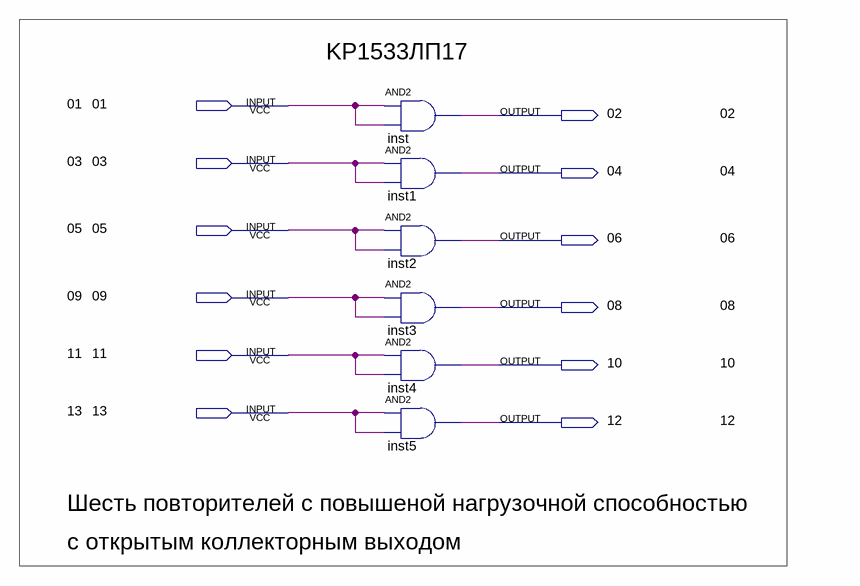
[diagram p0: schematic sheet]
// Quartus schematic KP1533LP17.bdf as structural Verilog: 6 symbols, 12 pins
module KP1533LP17 (
  input  \01 ,
  input  \03 ,
  input  \05 ,
  input  \09 ,
  input  \11 ,
  input  \13 ,
  output \02 ,
  output \04 ,
  output \06 ,
  output \08 ,
  output \10 ,
  output \12 
);

  and inst (\02 , \01 , \01 );
  and inst1 (\04 , \03 , \03 );
  and inst2 (\06 , \05 , \05 );
  and inst3 (\08 , \09 , \09 );
  and inst4 (\10 , \11 , \11 );
  and inst5 (\12 , \13 , \13 );

  // Notes on the sheet:
  //   KP1533ЛП17
  //   01
  //   02
  //   03
  //   04
  //   05
  //   06
  //   09
  //   08
  //   11
  //   10
  //   13
  //   12
  //   Шесть повторителей с повышеной нагрузочной способностью
  //   с открытым коллекторным выходом
endmodule
